# Altium schematic sheet 01 - Main.SchDoc: NRF Sensor
size A4; DocumentNumber: 1; Revision: 1.0.0; SheetNumber: 1; SheetTotal: 1
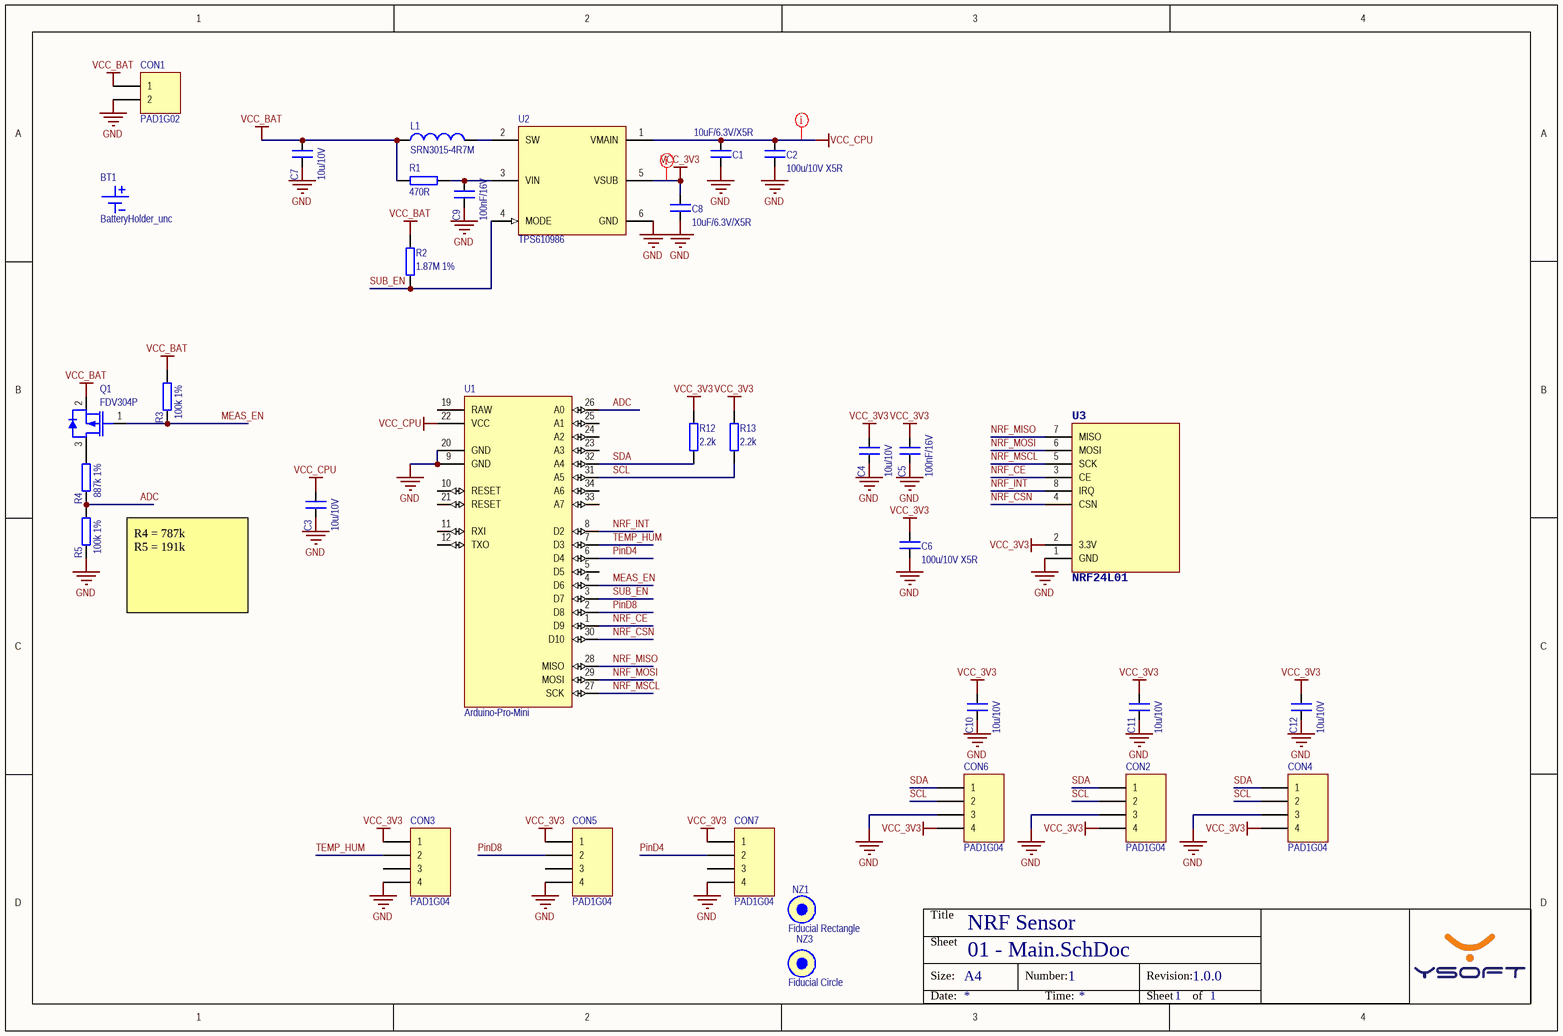
[diagram p0: 01 - Main.SchDoc]

## Parts
BT1  BatteryHolder_unc  [2AAHLDR]
C1  10uF/6.3V/X5R  [C-0603]
C2  100u/10V X5R  [C-1206]
C3  10u/10V  [C-0805]
C4  10u/10V  [C-0805]
C5  100nF/16V  [C-0603]
C6  100u/10V X5R  [C-1206]
C7  10u/10V  [C-0805]
C8  10uF/6.3V/X5R  [C-0603]
C9  100nF/16V  [C-0603]
C10  10u/10V  [C-0805]
C11  10u/10V  [C-0805]
C12  10u/10V  [C-0805]
CON1  PAD1G02  [HDR1X02S]
CON2  PAD1G04  [HDR1X04S]
CON3  PAD1G04  [HDR1X04S]
CON4  PAD1G04  [HDR1X04S]
CON5  PAD1G04  [HDR1X04S]
CON6  PAD1G04  [HDR1X04S]
CON7  PAD1G04  [HDR1X04S]
L1  SRN3015-4R7M  [TLU-SRN3015]
NZ1  Fiducial Rectangle  [Fiducial Rectangle]
NZ3  Fiducial Circle  [Fiducial Circle]
Q1  FDV304P  [SOT23-3L]
R1  470R  [R-0603]
R2  1.87M 1%  [R-0603]
R3  100k 1%  [R-0603]
R4  887k 1%  [R-0603]
R5  100k 1%  [R-0603]
R12  2.2k  [R-0603]
R13  2.2k  [R-0603]
U1  Arduino-Pro-Mini  [Arduino Mini Pro]
U2  TPS610986  [SON50P150X80-6N]
U3  NRF24L01  [NRF24L01]

## Nets
GND: C1.1 C2.1 C3.1 C4.1 C5.1 C6.1 C7.1 C8.1 C9.1 C10.1 C11.1 C12.1 CON1.2 CON2.3 CON3.4 CON4.3 CON5.4 CON6.3 CON7.4 R5.1 U1.9(GND) U1.20(GND) U2.6(GND) U3.1(GND)
VCC_3V3: C4.2 C5.2 C6.2 C8.2 C10.2 C11.2 C12.2 CON2.4 CON3.1 CON4.4 CON5.1 CON6.4 CON7.1 R12.2 R13.2 U2.5(VSUB) U3.2(3.3V)
VCC_BAT: C7.2 CON1.1 L1.1 Q1.2(SOURCE) R1.1 R2.2 R3.2
VCC_CPU: C1.2 C2.2 C3.2 U1.22(VCC) U2.1(VMAIN)
ADC: R4.1 R5.2 U1.26(A0)
MEAS_EN: Q1.1(GATE) R3.1 U1.4(D6)
NRF_CE: U1.1(D9) U3.3(CE)
NRF_CSN: U1.30(D10) U3.4(CSN)
NRF_INT: U1.8(D2) U3.8(IRQ)
NRF_MISO: U1.28(MISO) U3.7(MISO)
NRF_MOSI: U1.29(MOSI) U3.6(MOSI)
NRF_MSCL: U1.27(SCK) U3.5(SCK)
PinD4: CON7.2 U1.6(D4)
PinD8: CON5.2 U1.2(D8)
SCL: CON2.2 CON4.2 CON6.2 R13.1 U1.31(A5)
SDA: CON2.1 CON4.1 CON6.1 R12.1 U1.32(A4)
SUB_EN: R2.1 U1.3(D7) U2.4(MODE)
TEMP_HUM: CON3.2 U1.7(D3)
NetC9_2: C9.2 R1.2 U2.3(VIN)
NetL1_2: L1.2 U2.2(SW)
NetQ1_3: Q1.3(DRAIN) R4.2

Not connected (* = marked no-connect by the designer): CON3 3; CON5 3; CON7 3; U1 5(D5) 10(RESET) 11(RXI) 12(TXO) 19(RAW) 21(RESET) 23(A3) 24(A2) 25(A1) 33(A7) 34(A6)

## Layout directives
net class Power Net: VCC_3V3, VCC_CPU

## Notes on the sheet
- R4 = 787k
  R5 = 191k
- Title
- Size:
- Sheet
- A4
- Number:
- Revision:
- Date:
- Time:
- of

## Library data of the parts
BT1 = BatteryHoled_unc
C1 C8 = CMP-00255-2: SMD Ceramic Capacitor 0603 10uF/6.3V/X5R; Helios ID: CAP-0603 10uF/6.3V/X5R; Type: SMT; Package: 0603
C2 C6 = CMP-00294-5: SMD Ceramic Capacitor 1206 100u/10V X5R; Helios ID: CAP-1206 100u/10V X5R; Type: SMT; Package: 1206
C3 C4 C7 C10-C12 = CMP-00295-2: SMD Ceramic Capacitor 0805 10u/10V; Helios ID: CAP-0805 10u/10V; Type: SMT; Package: 0805
C5 C9 = CMP-00250-2: SMD Ceramic Capacitor 0603 100nF/16V; Helios ID: CAP-0603 100nF/16V; Type: SMT; Package: 0603
CON1 = CMP-00005-2: 1x2pin single row pads, 2.54mm; Helios ID: CON-PAD1G02; Type: TH
CON2-CON7 = CMP-00006-4: 1x4pin single row pads, 2.54mm; Helios ID: CON-PAD1G04; Type: TH
L1 = CMP-00463-1: Shielded inductor 4.7uH/1.2A 3x3mm; Type: SMT; Helios ID: IND-SRN3015-4R7M; HelpURL: http://www.bourns.com/docs/Product-Datasheets/SRN3015.pdf
NZ1 = CMP-00041-3: Helios ID: x004; Type: MECH
NZ3 = CMP-00042-4: Helios ID: x005; Type: MECH
Q1 = CMP-00186-2: P-Channel Digital FET 25V, 460mA; Helios ID: TRA-FDV304P; Type: SMT; Package: SOT23; HelpURL: http://www.fairchildsemi.com/ds/FD/FDV304P.pdf
R1 = CMP-00095-3: SMD Resistor 0603 470R; Value: 470; Helios ID: RES-0603 470R; Type: SMT; Package: 0603
R2 = CMP-00478-1: SMD Resistor 0603 1.87M 1%; Helios ID: RES-0603 1.87M 1%; Value: 1.87M; Type: SMT; Package: 0603
R3 R5 = CMP-00033-3: SMD Resistor 0603 100k 1%; Helios ID: RES-0603 100k 1%; Value: 100k; Type: SMT; Package: 0603
R4 = CMP-00324-2: SMD Resistor 0603 887k 1%; Helios ID: RES-0603 887k 1%; Value: 887k; Type: SMT; Package: 0603
R12 R13 = CMP-00080-3: SMD Resistor 0603 2k2; Helios ID: RES-0603 2k2; Value: 2.2k; Type: SMT; Package: 0603
U2 = CMP-00462-2: Ultra-Low Quiescent Current Synchronous Boost with Integrated Load Switch; Helios ID: IC-TPS610986DSE; HelpURL: http://www.ti.com/lit/gpn/tps610986; Package: DSE6; Type: SMT